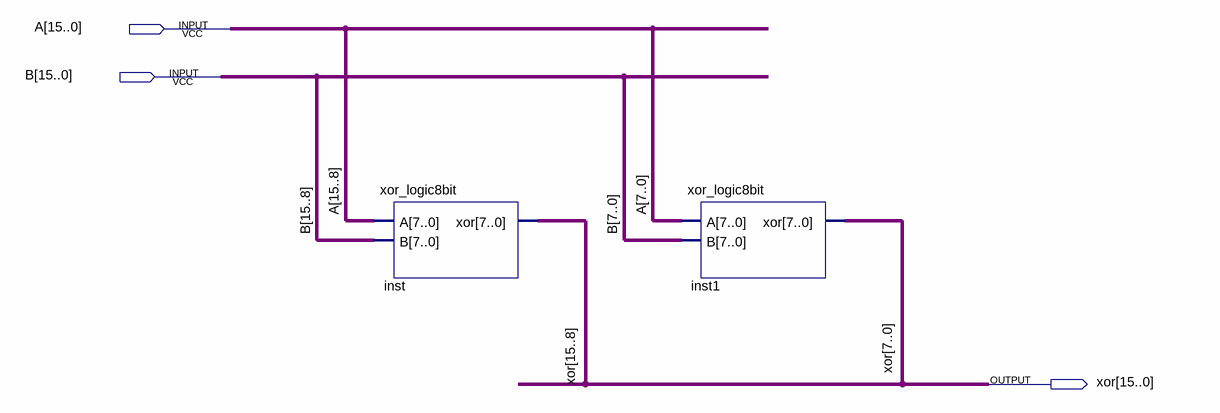
[diagram p0: schematic sheet]
// Quartus schematic xor_logic16bit.bdf as structural Verilog: 2 symbols, 3 pins
module xor_logic16bit (
  input  [15:0] A,
  input  [15:0] B,
  output [15:0] \xor 
);

  xor_logic8bit inst (.A(A[15:8]), .B(B[15:8]), .\xor (\xor [15:8]));
  xor_logic8bit inst1 (.A(A[7:0]), .B(B[7:0]), .\xor (\xor [7:0]));
endmodule
